# Altium schematic sheet DM1098EMB_MIPI_CAM.SchDoc: =project_title
size Tabloid; PageSetup: Record=PageOptions|CenterHorizontal=True|CenterVertical=True|PrintScale=0.73|XCorrection=1.00|YCorrection=1.00|PrintKind=0|BorderSize=5000000|LeftOffset=0|BottomOffset=0|Orientation=2|PaperLength=1000|PaperWidth=1000|Scale=100|PaperSource=7|PrintQuality=-4|MediaType=1|DitherType=10|PaperKind=A4|PrintScaleMode=1; CompanyName: Luxonis Holding; Organization: Luxonis Holding; Address1: 1925 Harmony Park Drive; Address2: Westminster, CO; Address3: 80234; Address4: United States; SheetNumber: 4; SheetTotal: 6
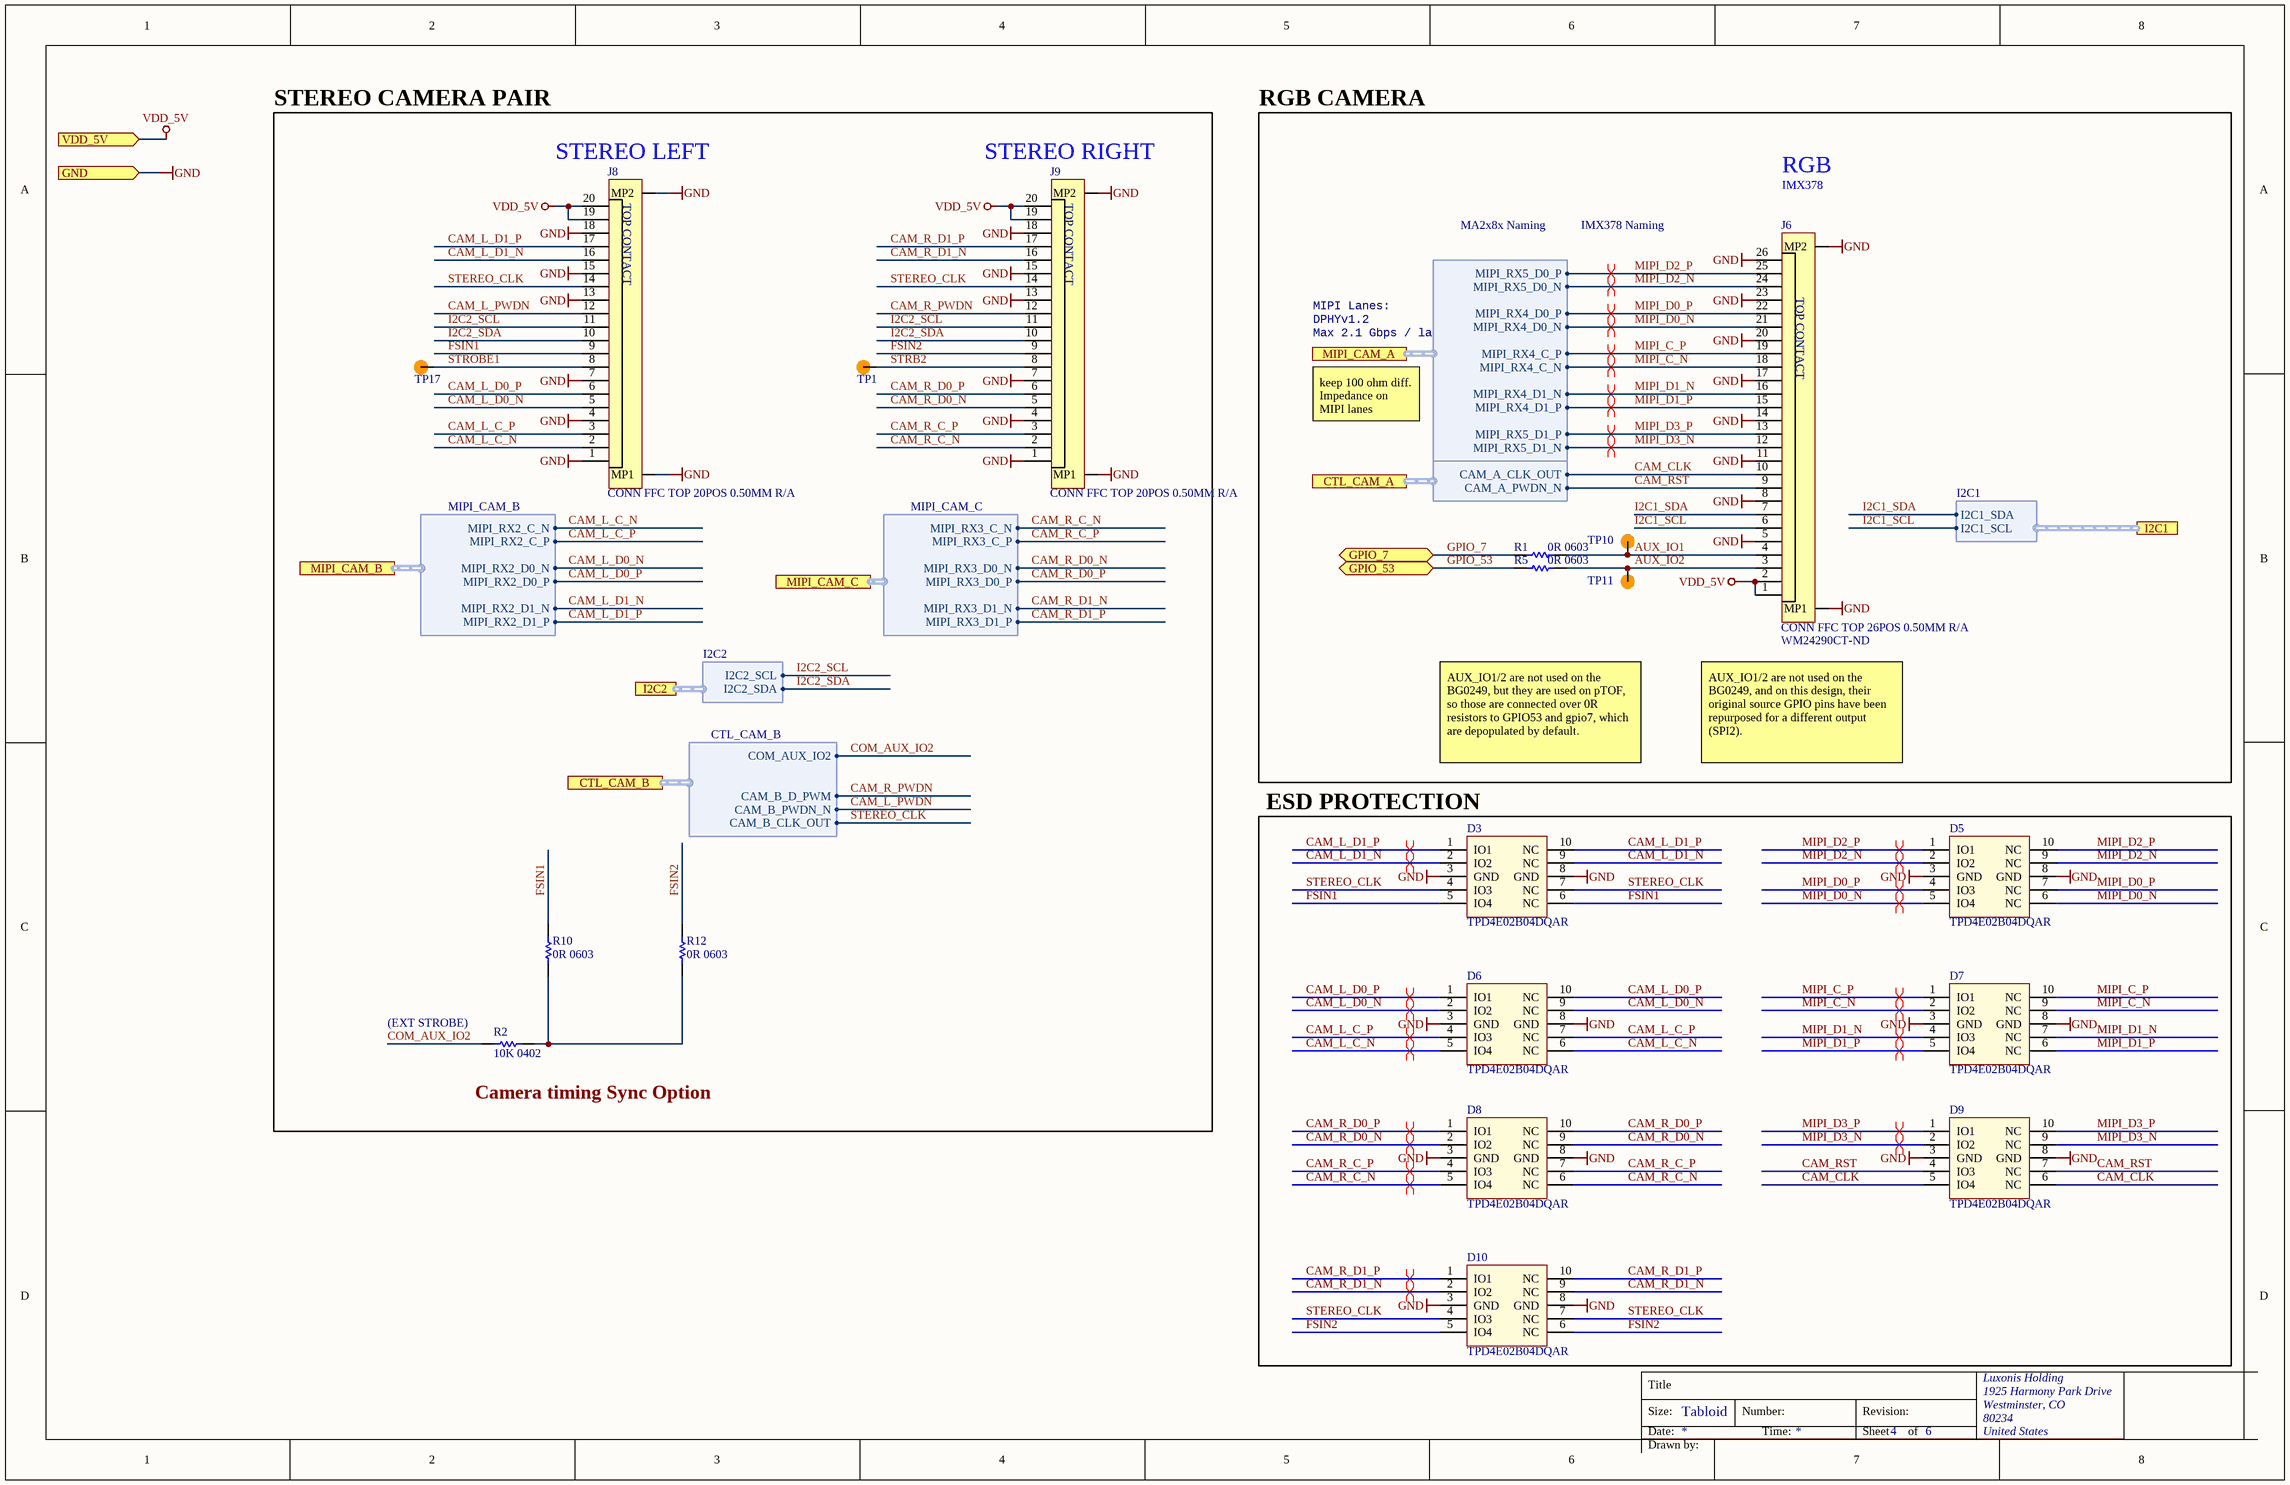
[diagram p0: DM1098EMB_MIPI_CAM.SchDoc]

## Parts
D3  TPD4E02B04DQAR  [TPD4E02B04DQAR]
D5  TPD4E02B04DQAR  [TPD4E02B04DQAR]
D6  TPD4E02B04DQAR  [TPD4E02B04DQAR]
D7  TPD4E02B04DQAR  [TPD4E02B04DQAR]
D8  TPD4E02B04DQAR  [TPD4E02B04DQAR]
D9  TPD4E02B04DQAR  [TPD4E02B04DQAR]
D10  TPD4E02B04DQAR  [TPD4E02B04DQAR]
J6  CONN FFC TOP 26POS 0.50MM R/A  Supplier Part Number 1: WM24290CT-ND  [5052782633]
J8  CONN FFC TOP 20POS 0.50MM R/A  [5052782033]
J9  CONN FFC TOP 20POS 0.50MM R/A  [5052782033]
R1  0R 0603  [RESC0603(1608)_N]
R2  10K 0402  [RESC0402(1005)_N]
R5  0R 0603  [RESC0603(1608)_N]
R10  0R 0603  [RESC0603(1608)_N]
R12  0R 0603  [RESC0603(1608)_N]
TP1  TP100_200_NS  [TP100_200_NS]  (value not drawn)  (no BOM)
TP10  TP100_200_NS  [TP100_200_NS]  (value not drawn)  (no BOM)
TP11  TP100_200_NS  [TP100_200_NS]  (value not drawn)  (no BOM)
TP17  TP100_200_NS  [TP100_200_NS]  (value not drawn)  (no BOM)

## Blocks framed on the sheet
ESD PROTECTION: D3 D5-D10

## Ports
CTL_CAM_A (harness CTL_CAM_A), CTL_CAM_B (harness CTL_CAM_B), GND (in), GPIO_7 (bidir), GPIO_53 (bidir), I2C1 (harness I2C1), I2C2 (harness I2C2), MIPI_CAM_A (harness MIPI_CAM_A), MIPI_CAM_B (harness MIPI_CAM_B), MIPI_CAM_C (harness MIPI_CAM_C), VDD_5V (in)

## Harnesses
MIPI_CAM_B: MIPI_RX2_C_P, MIPI_RX2_C_N, MIPI_RX2_D0_P, MIPI_RX2_D0_N, MIPI_RX2_D1_P, MIPI_RX2_D1_N
I2C2: I2C2_SDA, I2C2_SCL
I2C1: I2C1_SDA, I2C1_SCL
MIPI_CAM_A: MIPI_RX5_D0_P, MIPI_RX5_D0_N, MIPI_RX4_D0_P, MIPI_RX4_D0_N, MIPI_RX4_C_P, MIPI_RX4_C_N, MIPI_RX4_D1_N, MIPI_RX4_D1_P, MIPI_RX5_D1_P, MIPI_RX5_D1_N
MIPI_CAM_C: MIPI_RX3_C_P, MIPI_RX3_C_N, MIPI_RX3_D0_P, MIPI_RX3_D0_N, MIPI_RX3_D1_P, MIPI_RX3_D1_N
CTL_CAM_A: CAM_A_PWDN_N, CAM_A_CLK_OUT
CTL_CAM_B: CAM_B_CLK_OUT, CAM_B_PWDN_N, CAM_B_D_PWM, COM_AUX_IO2

## Nets
GND: D3.3(GND) D3.8(GND) D5.3(GND) D5.8(GND) D6.3(GND) D6.8(GND) D7.3(GND) D7.8(GND) D8.3(GND) D8.8(GND) D9.3(GND) D9.8(GND) D10.3(GND) D10.8(GND) J6.5 J6.8 J6.11 J6.14 J6.17 J6.20 J6.23 J6.26 J6.MP1 J6.MP2 J8.1 J8.4 J8.7 J8.13 J8.15 J8.18 J8.MP1 J8.MP2 J9.1 J9.4 J9.7 J9.13 J9.15 J9.18 J9.MP1 J9.MP2 ; port GND
VDD_5V: J6.1 J6.2 J8.19 J8.20 J9.19 J9.20 ; port VDD_5V
AUX_IO1: J6.4 R1.1 TP10.1
AUX_IO2: J6.3 R5.1 TP11.1
CAM_CLK: D9.5(IO4) D9.6(NC) J6.10 ; port CTL_CAM_A.CAM_A_CLK_OUT
CAM_L_C_N: D6.5(IO4) D6.6(NC) J8.2 ; port MIPI_CAM_B.MIPI_RX2_C_N
CAM_L_C_P: D6.4(IO3) D6.7(NC) J8.3 ; port MIPI_CAM_B.MIPI_RX2_C_P
CAM_L_D0_N: D6.2(IO2) D6.9(NC) J8.5 ; port MIPI_CAM_B.MIPI_RX2_D0_N
CAM_L_D0_P: D6.1(IO1) D6.10(NC) J8.6 ; port MIPI_CAM_B.MIPI_RX2_D0_P
CAM_L_D1_N: D3.2(IO2) D3.9(NC) J8.16 ; port MIPI_CAM_B.MIPI_RX2_D1_N
CAM_L_D1_P: D3.1(IO1) D3.10(NC) J8.17 ; port MIPI_CAM_B.MIPI_RX2_D1_P
CAM_L_PWDN: J8.12 ; port CTL_CAM_B.CAM_B_PWDN_N
CAM_R_C_N: D8.5(IO4) D8.6(NC) J9.2 ; port MIPI_CAM_C.MIPI_RX3_C_N
CAM_R_C_P: D8.4(IO3) D8.7(NC) J9.3 ; port MIPI_CAM_C.MIPI_RX3_C_P
CAM_R_D0_N: D8.2(IO2) D8.9(NC) J9.5 ; port MIPI_CAM_C.MIPI_RX3_D0_N
CAM_R_D0_P: D8.1(IO1) D8.10(NC) J9.6 ; port MIPI_CAM_C.MIPI_RX3_D0_P
CAM_R_D1_N: D10.2(IO2) D10.9(NC) J9.16 ; port MIPI_CAM_C.MIPI_RX3_D1_N
CAM_R_D1_P: D10.1(IO1) D10.10(NC) J9.17 ; port MIPI_CAM_C.MIPI_RX3_D1_P
CAM_R_PWDN: J9.12 ; port CTL_CAM_B.CAM_B_D_PWM
CAM_RST: D9.4(IO3) D9.7(NC) J6.9 ; port CTL_CAM_A.CAM_A_PWDN_N
COM_AUX_IO2: R2.1 ; port CTL_CAM_B.COM_AUX_IO2
FSIN1: D3.5(IO4) D3.6(NC) J8.9 R10.2
FSIN2: D10.5(IO4) D10.6(NC) J9.9 R12.2
GPIO_7: R1.2 ; port GPIO_7
GPIO_53: R5.2 ; port GPIO_53
I2C1_SCL: J6.6 ; port I2C1.I2C1_SCL
I2C1_SDA: J6.7 ; port I2C1.I2C1_SDA
I2C2_SCL: J8.11 J9.11 ; port I2C2.I2C2_SCL
I2C2_SDA: J8.10 J9.10 ; port I2C2.I2C2_SDA
MIPI_C_N: D7.2(IO2) D7.9(NC) J6.18 ; port MIPI_CAM_A.MIPI_RX4_C_N
MIPI_C_P: D7.1(IO1) D7.10(NC) J6.19 ; port MIPI_CAM_A.MIPI_RX4_C_P
MIPI_D0_N: D5.5(IO4) D5.6(NC) J6.21 ; port MIPI_CAM_A.MIPI_RX4_D0_N
MIPI_D0_P: D5.4(IO3) D5.7(NC) J6.22 ; port MIPI_CAM_A.MIPI_RX4_D0_P
MIPI_D1_N: D7.4(IO3) D7.7(NC) J6.16 ; port MIPI_CAM_A.MIPI_RX4_D1_N
MIPI_D1_P: D7.5(IO4) D7.6(NC) J6.15 ; port MIPI_CAM_A.MIPI_RX4_D1_P
MIPI_D2_N: D5.2(IO2) D5.9(NC) J6.24 ; port MIPI_CAM_A.MIPI_RX5_D0_N
MIPI_D2_P: D5.1(IO1) D5.10(NC) J6.25 ; port MIPI_CAM_A.MIPI_RX5_D0_P
MIPI_D3_N: D9.2(IO2) D9.9(NC) J6.12 ; port MIPI_CAM_A.MIPI_RX5_D1_N
MIPI_D3_P: D9.1(IO1) D9.10(NC) J6.13 ; port MIPI_CAM_A.MIPI_RX5_D1_P
STEREO_CLK: D3.4(IO3) D3.7(NC) D10.4(IO3) D10.7(NC) J8.14 J9.14 ; port CTL_CAM_B.CAM_B_CLK_OUT
STRB2: J9.8 TP1.1
STROBE1: J8.8 TP17.1
NetR2_2: R2.2 R10.1 R12.1

## Layout directives
differential pair: CAM_L_C_N, CAM_L_C_P, CAM_L_D0_N, CAM_L_D0_P, CAM_L_D1_N, CAM_L_D1_P, CAM_R_C_N, CAM_R_C_P, CAM_R_D0_N, CAM_R_D0_P, CAM_R_D1_N, CAM_R_D1_P, MIPI_C_N, MIPI_C_P, MIPI_D0_N, MIPI_D0_P, MIPI_D1_N, MIPI_D1_P, MIPI_D2_N, MIPI_D2_P, MIPI_D3_N, MIPI_D3_P

## Notes on the sheet
- STEREO CAMERA PAIR
- (near J8) STEREO LEFT
- (near J9) STEREO RIGHT
- RGB CAMERA
- MA2x8x Naming
- IMX378 Naming
- RGB
- IMX378
- MIPI Lanes:
- Max 2.1 Gbps / lane
- DPHYv1.2
- keep 100 ohm diff. Impedance on MIPI lanes
- AUX_IO1/2 are not used on the BG0249, but they are used on pTOF, so those are connected over 0R resistors to GPIO53 and gpio7, which are depopulated by default.
- AUX_IO1/2 are not used on the BG0249, and on this design, their original source GPIO pins have been repurposed for a different output (SPI2).
- (near R2) (EXT STROBE)
- (near R2) Camera timing Sync Option
- Title
- Size:
- Date:
- Tabloid
- Number:
- Time:
- Revision:
- Sheet
- of
- Drawn by:
- (in symbol 5052782033) TOP CONTACT
- (in symbol 5052782633) TOP CONTACT

## Library data of the parts
D3 D5-D10 = TPD4E02B04DQAR: TVS DIODE 3.6V 8.8V 10USON 8.8V (Typ) Clamp 5A (8/20µs) Ipp Tvs Diode Surface Mount 10-USON (2.5x1); Manufacturer 1: Texas Instruments; Number of Bidirectional Channels: 4; Min Breakdown Voltage: 5.5V; Peak Pulse Power: 17W; Power Line Protection: No; Interface: USB,HDMI; Supplier 1: Digi-Key; Manufacturer Part Number 1: TPD4E02B04DQAR; Stock 1: 25615; Pricing 1: 1=0.69000, 10=0.60800, 100=0.46650, 500=0.36874, 1000=0.29499 (USD); RoHS: Yes; Mount: Surface Mount; Number of Pins: 10; Min Operating Temperature: -40°C; Max Operating Temperature: 125°C; Packaging: Cut Tape; Reverse Standoff Voltage: 3.6V; Clamping Voltage: 8.8V; Operating Supply Voltage: 3.6V; Peak Pulse Current: 5A; Number of Channels: 4; Composition: Zener; REACH SVHC: No SVHC; Lead Free: Lead Free; ComponentLink1URL: http://www.ti.com/general/docs/lit/getliterature.tsp?genericPartNumber=TPD4E02B04&amp;&amp;fileType=pdf&src-supplier=Element14; ComponentLink1Description: http://www.ti.com/general/docs/lit/getliterature.tsp?genericPartNumber=TPD4E02B04&amp;&amp;fileType=pdf&src-supplier=Element14; ComponentLink2URL: http://www.ti.com/lit/ds/symlink/tpd4e02b04.pdf?src-supplier=Farnell; ComponentLink2Description: http://www.ti.com/lit/ds/symlink/tpd4e02b04.pdf?src-supplier=Farnell; ComponentLink3URL: http://www.ti.com/lit/ds/symlink/tpd4e02b04.pdf?src-supplier=Newark; ComponentLink3Description: http://www.ti.com/lit/ds/symlink/tpd4e02b04.pdf?src-supplier=Newark; ComponentLink4URL: http://www.ti.com/lit/ds/symlink/tpd4e02b04.pdf?src-supplier=Digi-Key; ComponentLink4Description: http://www.ti.com/lit/ds/symlink/tpd4e02b04.pdf?src-supplier=Digi-Key; Supplier Part Number 1: 296-43875-1-ND
J6 = 5052782633: 0.5 Ffc Zif Btm Cont Embt Pkg 0.5 Fpc Zif Btm FS19; Manufacturer 1: Molex; Manufacturer Part Number 1: 505278-2633; Actuator Material: Nylon,Glass,Polyamide; Number of Positions: 26; Voltage Rating: 50V; Current Rating: 500mA; Pitch: 0.02inch; Supplier 1: Digi-Key; RoHS: Yes; Category: Connectors; Stock 1: 8571; Pricing 1: 1=0,85000, 10=0,70400, 100=0,58660, 1000=0,46928 (USD); Mount: Surface Mount; Housing Material: Polymer; Contact Material: Bronze; Contact Plating: Tin; Min Operating Temperature: -40°C; Max Operating Temperature: 85°C; Packaging: Tape and Reel; Termination: Solder; Flammability Rating: UL94 V-0; ComponentLink1URL: http://www.molex.com/pdm_docs/sd/5052782633_sd.pdf?src-supplier=Digi-Key; ComponentLink1Description: http://www.molex.com/pdm_docs/sd/5052782633_sd.pdf?src-supplier=Digi-Key
J8 J9 = 5052782033: 0.5 Ffc Zif Btm Cont Embt Pkg 0.5 Fpc Zif Btm FS19; Manufacturer 1: Molex; Manufacturer Part Number 1: 505278-2033; Actuator Material: Nylon,Glass,Polyamide; Number of Positions: 20; Voltage Rating: 50V; Current Rating: 500mA; Pitch: 0.02inch; Supplier 1: Digi-Key; RoHS: Yes; Category: Connectors; Stock 1: 13841; Pricing 1: 1=0,71000, 10=0,59800, 100=0,46540, 1000=0,36564 (USD); Mount: Surface Mount; Contact Plating: Tin; Contact Material: Bronze; Housing Material: Polymer; Min Operating Temperature: -40°C; Max Operating Temperature: 85°C; Packaging: Tape and Reel; Termination: Solder; Flammability Rating: UL94 V-0; ComponentLink1URL: http://www.molex.com/pdm_docs/sd/5052782033_sd.pdf?src-supplier=Digi-Key; ComponentLink1Description: http://www.molex.com/pdm_docs/sd/5052782033_sd.pdf?src-supplier=Digi-Key
R1 R5 R10 R12 = CRCW06030000Z0EA: RES SMD 0 OHM JUMPER 1/10W 0603 0 Ohms Jumper 0.1W, 1/10W Chip Resistor 0603 (1608 Metric) Automotive AEC-Q200 Thick Film; Manufacturer 1: Vishay; Manufacturer Part Number 1: CRCW0603-0000Z0EA; Resistance: 0mR; Power Rating: 100mW; Voltage Rating: 75V; Temperature Coefficient: 100ppm/°C; Tolerance: 5%; Current Rating: 2A; Supplier 1: Digi-Key; Stock 1: 742743; Pricing 1: 1=0.100000, 10=0.034000, 25=0.024400, 50=0.018600, 100=0.013800, 250=0.010480, 500=0.008400, 1000=0.006180 (USD); RoHS: Yes; Mount: Surface Mount; Case/Package: 0603; Weight: 7.1E-05oz; Contact Plating: Tin,Lead; Case Code (Metric): 1608; Case Code (Imperial): 0603; Min Operating Temperature: -55°C; Max Operating Temperature: 155°C; Composition: Thick Film; Termination: SMD/SMT; Packaging: Tape and Reel; Package Quantity: 1; Number of Terminations: 2; Military Standard: Not; Max Power Dissipation: 100mW; Voltage Rating (DC): 75V; Features: Automotive AEC-Q200; Working Voltage: 75V; Length: 1.55mm; Height: 0.02inch; Width: 0.033inch; Depth: 0.85mm; Radiation Hardening: No; Lead Free: Lead Free; REACH SVHC: Unknown; ComponentLink1URL: https://datasheet.ciiva.com/2461/dcrcwe3-2461968.pdf?src-supplier=Digi-Key; ComponentLink1Description: https://datasheet.ciiva.com/2461/dcrcwe3-2461968.pdf?src-supplier=Digi-Key; ComponentLink2URL: https://datasheet.ciiva.com/2461/dcrcwe3-2461969.pdf?src-supplier=Digi-Key; ComponentLink2Description: https://datasheet.ciiva.com/2461/dcrcwe3-2461969.pdf?src-supplier=Digi-Key; ComponentLink3URL: https://datasheet.ciiva.com/2461/dcrcwe3-2461970.pdf?src-supplier=Digi-Key; ComponentLink3Description: https://datasheet.ciiva.com/2461/dcrcwe3-2461970.pdf?src-supplier=Digi-Key; ComponentLink4URL: https://datasheet.ciiva.com/8340/dcrcwe3-8340197.pdf?src-supplier=Avnet; ComponentLink4Description: https://datasheet.ciiva.com/8340/dcrcwe3-8340197.pdf?src-supplier=Avnet; ComponentLink5URL: https://datasheet.ciiva.com/16941/dcrcw-16941302.pdf?src-supplier=Avnet+Europe; ComponentLink5Description: https://datasheet.ciiva.com/16941/dcrcw-16941302.pdf?src-supplier=Avnet+Europe; ComponentLink6URL: https://datasheet.ciiva.com/16199/dcrcwe3-16199063.pdf?src-supplier=Future+Electronics; ComponentLink6Description: https://datasheet.ciiva.com/16199/dcrcwe3-16199063.pdf?src-supplier=Future+Electronics; ComponentLink7URL: https://datasheet.ciiva.com/16725/70201119-16725175.pdf?src-supplier=Allied+Electronics; ComponentLink7Description: https://datasheet.ciiva.com/16725/70201119-16725175.pdf?src-supplier=Allied+Electronics; ComponentLink8URL: https://datasheet.ciiva.com/26316/fld-crcw-e3-data-en-26316615.pdf?src-supplier=Distrelec; ComponentLink8Description: https://datasheet.ciiva.com/26316/fld-crcw-e3-data-en-26316615.pdf?src-supplier=Distrelec; ComponentLink9URL: https://datasheet.ciiva.com/5544/dcrcwe3-109170-5544344.pdf?src-supplier=Mouser; ComponentLink9Description: https://datasheet.ciiva.com/5544/dcrcwe3-109170-5544344.pdf?src-supplier=Mouser; ComponentLink10URL: https://datasheet.ciiva.com/7841/1720486-7841816.pdf?src-supplier=Element14; ComponentLink10Description: https://datasheet.ciiva.com/7841/1720486-7841816.pdf?src-supplier=Element14; ComponentLink11URL: https://datasheet.ciiva.com/7841/1720486-7841817.pdf?src-supplier=Element14; ComponentLink11Description: https://datasheet.ciiva.com/7841/1720486-7841817.pdf?src-supplier=Element14; ComponentLink12URL: https://datasheet.ciiva.com/7841/125364-7841818.pdf?src-supplier=Element14; ComponentLink12Description: https://datasheet.ciiva.com/7841/125364-7841818.pdf?src-supplier=Element14; ComponentLink13URL: https://datasheet.ciiva.com/16721/70201119-16721450.pdf?src-supplier=Allied+Electronics; ComponentLink13Description: https://datasheet.ciiva.com/16721/70201119-16721450.pdf?src-supplier=Allied+Electronics; Supplier Part Number 1: 541-0.0GCT-ND
R2 = RC0402FR-1310KL: RES SMD 10K OHM 1% 0402 1/16W Chip Resistor, 0402 [1005 Metric], 10 kohm, RC Series, 50 V, Thick Film, 62.5 mW; Manufacturer 1: Yageo; Resistance: 10kR; Temperature Coefficient: 100ppm/°C; Power Rating: 62.5mW; Voltage Rating: 50V; ComponentLink1URL: https://datasheet.ciiva.com/16940/pyu-rc0402-51-rohs-l-6-16940293.pdf?src-supplier=Avnet+Europe; ComponentLink1Description: https://datasheet.ciiva.com/16940/pyu-rc0402-51-rohs-l-6-16940293.pdf?src-supplier=Avnet+Europe; ComponentLink2URL: https://datasheet.ciiva.com/28386/pyu-rc0402-51-rohs-l-6-28386855.pdf?src-supplier=Avnet+Europe; ComponentLink2Description: https://datasheet.ciiva.com/28386/pyu-rc0402-51-rohs-l-6-28386855.pdf?src-supplier=Avnet+Europe; ComponentLink3URL: https://datasheet.ciiva.com/16740/pyu-rc0402-51-rohs-l-6-r-16740602.pdf?src-supplier=Future+Electronics; ComponentLink3Description: https://datasheet.ciiva.com/16740/pyu-rc0402-51-rohs-l-6-r-16740602.pdf?src-supplier=Future+Electronics; ComponentLink4URL: https://datasheet.ciiva.com/8891/pyu-rc0402-51-rohs-l-6-8891339.pdf?src-supplier=Avnet; ComponentLink4Description: https://datasheet.ciiva.com/8891/pyu-rc0402-51-rohs-l-6-8891339.pdf?src-supplier=Avnet; ComponentLink5URL: https://datasheet.ciiva.com/5557/pyu-rc0402-51-rohs-l-6-r-5557997.pdf?src-supplier=Mouser; ComponentLink5Description: https://datasheet.ciiva.com/5557/pyu-rc0402-51-rohs-l-6-r-5557997.pdf?src-supplier=Mouser; ComponentLink6URL: https://datasheet.ciiva.com/7983/1018594-7983533.pdf?src-supplier=Element14; ComponentLink6Description: https://datasheet.ciiva.com/7983/1018594-7983533.pdf?src-supplier=Element14; Supplier 1: Newark; Manufacturer Part Number 1: RC0402FR-1310KL; Stock 1: 62239; Pricing 1: 1=0.10000, 25=0.01200, 100=0.00400, 250=0.00400, 500=0.00300, 1000=0.00300 (USD); RoHS: Yes; Case/Package: 0402; Number of Pins: 2; Contact Plating: Tin,Matte,Lead; Case Code (Imperial): 0402; Case Code (Metric): 1005; Min Operating Temperature: -55°C; Max Operating Temperature: 155°C; Tolerance: 1%; Composition: Thick Film; Packaging: Tape and Reel; Termination: SMD/SMT; Military Standard: Not; Voltage Rating (DC): 50V; Working Voltage: 50V; Number of Terminations: 2; Length: 1mm; Depth: 0.5mm; Radiation Hardening: No; REACH SVHC: No SVHC; Lead Free: Lead Free; Supplier Part Number 1: 67R9960; Supplier 2: Future Electronics; Supplier 3: Mouser; Supplier 4: Element14; Supplier Part Number 2: RC0402FR-1310KL-CUTT; Supplier Part Number 3: 603-RC0402FR-1310KL; Supplier Part Number 4: 1799235
TP1 TP10 TP11 TP17 = TEST_POINT